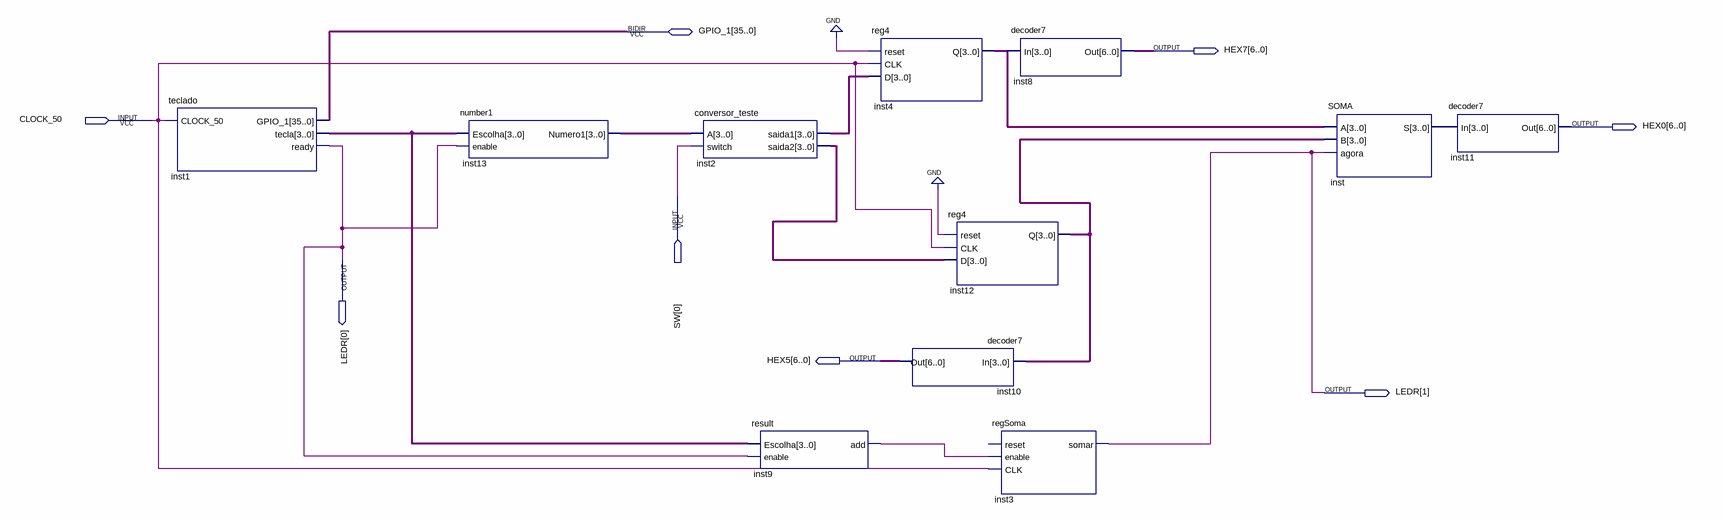
[diagram p0: schematic sheet]
// Quartus schematic blocosomateste.bdf as structural Verilog: 11 symbols, 8 pins
module blocosomateste (
  input  CLOCK_50,
  input  [0:0] SW,
  inout  [35:0] GPIO_1,
  output [6:0] HEX7,
  output [6:0] HEX0,
  output [1:0] LEDR,
  output [6:0] HEX5
);

  wire inst9_add;
  wire [3:0] inst1_tecla, inst2_saida1, inst2_saida2, inst4_q, inst12_q, inst13_numero1, inst_s;

  teclado inst1 (.CLOCK_50(CLOCK_50), .tecla(inst1_tecla), .ready(LEDR[0]), .GPIO_1(GPIO_1));
  number1 inst13 (.Escolha(inst1_tecla), .enable(LEDR[0]), .Numero1(inst13_numero1));
  conversor_teste inst2 (.A(inst13_numero1), .switch(SW[0]), .saida1(inst2_saida1), .saida2(inst2_saida2));
  result inst9 (.Escolha(inst1_tecla), .enable(LEDR[0]), .add(inst9_add));
  reg4 inst4 (.reset(1'b0), .CLK(CLOCK_50), .D(inst2_saida1), .Q(inst4_q));
  decoder7 inst10 (.In(inst12_q), .Out(HEX5));
  reg4 inst12 (.reset(1'b0), .CLK(CLOCK_50), .D(inst2_saida2), .Q(inst12_q));
  decoder7 inst8 (.In(inst4_q), .Out(HEX7));
  regSoma inst3 (.enable(inst9_add), .CLK(CLOCK_50), .somar(LEDR[1]));  // open: reset
  SOMA inst (.A(inst4_q), .B(inst12_q), .agora(LEDR[1]), .S(inst_s));
  decoder7 inst11 (.In(inst_s), .Out(HEX0));
endmodule
